# Altium schematic sheet AMS.SchDoc
size Legal
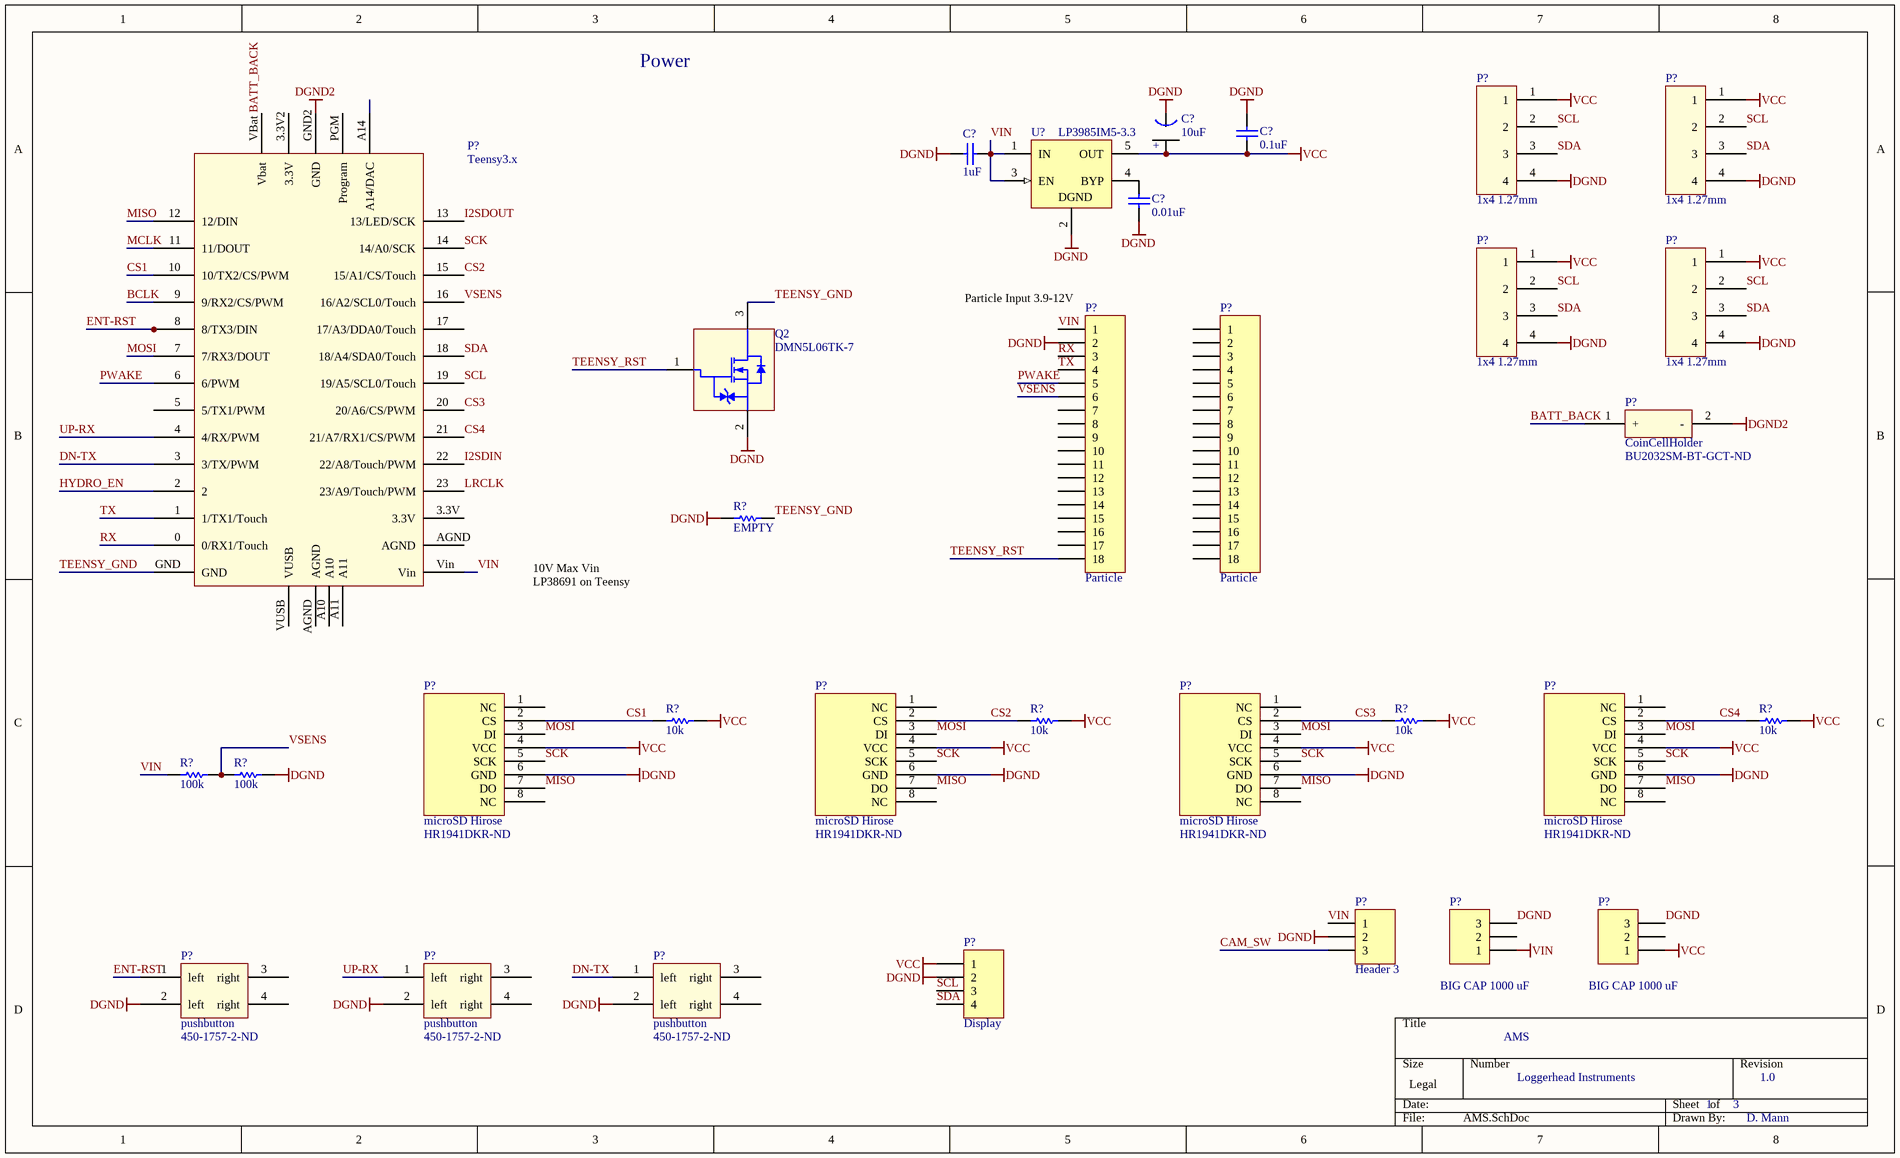
[diagram p0: AMS.SchDoc]

## Parts
(Parts that share a designator on the sheet are numbered #1, #2 ... from top to bottom, then left to right.)
C?#1  0.1uF  [0402]
C?#2  10uF  [Tant0805]
C?#3  1uF  [0402]
C?#4  0.01uF  [0402]
P?#1  1x4 1.27mm  [Header1x4 1.27mm]
P?#2  1x4 1.27mm  [Header1x4 1.27mm]
P?#3  1x4 1.27mm  [Header1x4 1.27mm]
P?#4  1x4 1.27mm  [Header1x4 1.27mm]
P?#5  Particle  [HDR1X18]
P?#6  Particle  [HDR1X18]
P?#7  Teensy3.x  [Teensy3.x]
P?#8  CoinCellHolder  Supplier Part Number 1: BU2032SM-BT-GCT-ND  [CoinCellHolder]
P?#9  microSD Hirose  Supplier Part Number 1: HR1941DKR-ND  [DM3D microSD]
P?#10  microSD Hirose  Supplier Part Number 1: HR1941DKR-ND  [DM3D microSD]
P?#11  microSD Hirose  Supplier Part Number 1: HR1941DKR-ND  [DM3D microSD]
P?#12  microSD Hirose  Supplier Part Number 1: HR1941DKR-ND  [DM3D microSD]
P?#13  Header 3  [HDR1X3]
P?#14  Display  [HDR1X4]
P?#15  BIG CAP 1000 uF  [HDR1X3]
P?#16  BIG CAP 1000 uF  [HDR1X3]
P?#17  pushbutton  Supplier Part Number 1: 450-1757-2-ND  [SOP4]
P?#18  pushbutton  Supplier Part Number 1: 450-1757-2-ND  [SOP4]
P?#19  pushbutton  Supplier Part Number 1: 450-1757-2-ND  [SOP4]
Q2  DMN5L06TK-7  [SOT-523]
R?#1  EMPTY  [3-0603]
R?#2  10k  [3-0603]
R?#3  10k  [3-0603]
R?#4  10k  [3-0603]
R?#5  10k  [3-0603]
R?#6  100k  [3-0603]
R?#7  100k  [3-0603]
U?  LP3985IM5-3.3  [MF05A_N]

## Nets
DGND: C?#1.2 C?#2.1(GND) C?#3.2 C?#4.2 P?#1.4 P?#2.4 P?#3.4 P?#4.4 P?#5.2 P?#9.6(GND) P?#10.6(GND) P?#11.6(GND) P?#12.6(GND) P?#13.2 P?#14.2 P?#15.3 P?#16.3 P?#17.2(left) P?#18.2(left) P?#19.2(left) Q2.2(S) R?#1.2 R?#7.1 U?.2(GND)
DGND2: P?#7.GND2(GND) P?#8.2(-)
VCC: C?#1.1 C?#2.2(+) P?#1.1 P?#2.1 P?#3.1 P?#4.1 P?#9.4(VCC) P?#10.4(VCC) P?#11.4(VCC) P?#12.4(VCC) P?#14.1 P?#16.1 R?#2.1 R?#3.1 R?#4.1 R?#5.1 U?.5(OUT)
VIN: C?#3.1 P?#5.1 P?#7.Vin P?#13.1 P?#15.1 R?#6.2 U?.1(IN) U?.3(EN)
BATT_BACK: P?#7.VBat(Vbat) P?#8.1(+)
BCLK: P?#7.9(9/RX2/CS/PWM)
CAM_SW: P?#13.3
CS1: P?#7.10(10/TX2/CS/PWM) P?#9.2(CS) R?#2.2
CS2: P?#7.15(15/A1/CS/Touch) P?#10.2(CS) R?#3.2
CS3: P?#7.20(20/A6/CS/PWM) P?#11.2(CS) R?#4.2
CS4: P?#7.21(21/A7/RX1/CS/PWM) P?#12.2(CS) R?#5.2
DN-TX: P?#7.3(3/TX/PWM) P?#19.1(left)
ENT-RST: P?#7.8(8/TX3/DIN) P?#17.1(left)
HYDRO_EN: P?#7.2
I2SDIN: P?#7.22(22/A8/Touch/PWM)
I2SDOUT: P?#7.13(13/LED/SCK)
LRCLK: P?#7.23(23/A9/Touch/PWM)
MCLK: P?#7.11(11/DOUT)
MISO: P?#7.12(12/DIN) P?#9.7(DO) P?#10.7(DO) P?#11.7(DO) P?#12.7(DO)
MOSI: P?#7.7(7/RX3/DOUT) P?#9.3(DI) P?#10.3(DI) P?#11.3(DI) P?#12.3(DI)
PWAKE: P?#5.5 P?#7.6(6/PWM)
RX: P?#5.3 P?#7.0(0/RX1/Touch)
SCK: P?#7.14(14/A0/SCK) P?#9.5(SCK) P?#10.5(SCK) P?#11.5(SCK) P?#12.5(SCK)
SCL: P?#1.2 P?#2.2 P?#3.2 P?#4.2 P?#7.19(19/A5/SCL0/Touch) P?#14.3
SDA: P?#1.3 P?#2.3 P?#3.3 P?#4.3 P?#7.18(18/A4/SDA0/Touch) P?#14.4
TEENSY_GND: P?#7.GND Q2.3(D) R?#1.1
TEENSY_RST: P?#5.18 Q2.1(G)
TX: P?#5.4 P?#7.1(1/TX1/Touch)
UP-RX: P?#7.4(4/RX/PWM) P?#18.1(left)
VSENS: P?#5.6 P?#7.16(16/A2/SCL0/Touch) R?#6.1 R?#7.2
NetC?#4_1: C?#4.1 U?.4(BYP)

Not connected (* = marked no-connect by the designer): P?#5 7 8 9 10 11 12 13 14 15 16 17; P?#6 1 2 3 4 5 6 7 8 9 10 11 12 13 14 15 16 17 18; P?#7 3.3V 3.3V2(3.3V) 5(5/TX1/PWM) 17(17/A3/DDA0/Touch) A10 A11 A14(A14/DAC) AGND PGM(Program) VUSB; P?#9 1(NC) 8(NC); P?#10 1(NC) 8(NC); P?#11 1(NC) 8(NC); P?#12 1(NC) 8(NC); P?#15 2; P?#16 2; P?#17 3(right) 4(right); P?#18 3(right) 4(right); P?#19 3(right) 4(right)

## Notes on the sheet
- Power
- (near P?#5) Particle Input 3.9-12V
- 10V Max Vin
  LP38691 on Teensy
- AMS
- Loggerhead Instruments
- 1
- 3
- 1.0
- D. Mann
- (in symbol LP3985IM5-3.3) DGND

## Library data of the parts
C?#1 = C0402: Ceramic Chip Capacitor - Standard; Note: Footprint corresponds to dimensions for bulk cassette packaging. This case size has tightened tolerances.; Published: 17-Jul-2002; LatestRevisionDate: 19-Mar-2004; LatestRevisionNote: Silkscreen size reduced.; DatasheetDocument: Mar-2001; PackageDocument: Mar-2001; PackageReference: 0402; Publisher: Altium Limited; Code_JEITA: 0402; Code_IPC: 1005 [0402]; ComponentLink1Description: Manufacturer Link; ComponentLink1URL: http://www.kemet.com/; ComponentLink2Description: Datasheet; ComponentLink2URL: http://www.kemet.com/kemet/web/homepage/kechome.nsf/vapubfilesname/F3102TA.pdf/$file/F3102TA.pdf; Value: 0.1uF
C?#2 = Tant0805: Value: 10uF
C?#3 C?#4 = C0402: Ceramic Chip Capacitor - Standard; Note: Footprint corresponds to dimensions for bulk cassette packaging. This case size has tightened tolerances.; Value: 0.1uF; Published: 17-Jul-2002; LatestRevisionDate: 19-Mar-2004; LatestRevisionNote: Silkscreen size reduced.; DatasheetDocument: Mar-2001; PackageDocument: Mar-2001; PackageReference: 0402; Publisher: Altium Limited; Code_JEITA: 0402; Code_IPC: 1005 [0402]; ComponentLink1Description: Manufacturer Link; ComponentLink1URL: http://www.kemet.com/; ComponentLink2Description: Datasheet; ComponentLink2URL: http://www.kemet.com/kemet/web/homepage/kechome.nsf/vapubfilesname/F3102TA.pdf/$file/F3102TA.pdf
P?#1-P?#4 = Header 1x4 1.27mm
P?#5 P?#6 = Header 18: Header, 18-Pin; LatestRevisionDate: 17-Jul-2002; LatestRevisionNote: Re-released for DXP Platform.; Publisher: Altium Limited
P?#13 P?#15 P?#16 = Header 3: Header, 3-Pin; LatestRevisionDate: 17-Jul-2002; LatestRevisionNote: Re-released for DXP Platform.; Publisher: Altium Limited
P?#14 = Header 4: Header, 4-Pin; LatestRevisionDate: 17-Jul-2002; LatestRevisionNote: Re-released for DXP Platform.; Publisher: Altium Limited
Q2 = FET DMN5L06TK-7: Ultra-low leakage Enhanced MOSFET; Fabrication Tested: NO; Creator and Date: Will Flanery 2010-09-02; Footprint Verified By: *; Schematic Verified By: *; Vendor Info Verified By: *; Supplier 1: Digi-Key; Supplier Part Number 1: DMN5L06TKDICT-ND; HelpURL: http://www.diodes.com/datasheets/ds30926.pdf
R?#1-R?#7 = ERJ3RK: Precision Thick Film Chip Resistor, 10 Ohm to 1M Ohm Range, 1% and 0.5% Tolerance, 0603 Size, 0.063 W; Published: 17-Dec-2003; LatestRevisionDate: 19-Mar-2004; LatestRevisionNote: Silkscreen size reduced.; PackageDocument: Mar-2003; PackageReference: 3-0603; Publisher: Altium Limited; Code_IPC: 1608 [0603]; ComponentLink1Description: Manufacturer Link; ComponentLink1URL: http://www.panasonic.com/industrial/components/resistive_products.htm; ComponentLink2Description: Datasheet; ComponentLink2URL: http://www.panasonic.com/industrial/components/pdf/AOA0000CE2.pdf
U? = LP3985IM5-3.3: Micropower, 150mA Low-Noise Ultra Low-Dropout CMOS Voltage Regulator; Manufacturer: National Semiconductor; CompType: LDO IC; PackageTopMarking: LDQB*XTT; PowerWise: N; Published: 4-Dec-2008; DatasheetVersion: Aug-2005; PackageVersion: revD, Aug-2008; PackageReference: MF05A; Publisher: Altium Limited; PackageDescription: Molded SOT-23, .115 x .063 x .040 in Body, 5 Lead, .0375 in Pitch; PartNumber: LP3985IM5-3.3; RoHS: O; PinCount: 5; DigiKeyPartNumber: LP3985IM5-3.3CT-ND; ComponentLink1Description: LP3985 Datasheet; ComponentLink1URL: http://www.national.com/ds/LP/LP3985.pdf; ComponentLink2Description: LP3985 Web Page; ComponentLink2URL: http://www.national.com/pf/LP/LP3985.html; ComponentLink3Description: MF05A Package Page; ComponentLink3URL: http://www.national.com/packaging/folders/mf05a.html
P?#8 = CoinCellHolder: Supplier 1: Digi-Key
P?#9-P?#12 = microSD Hirose: Supplier 1: Digi-Key
P?#17-P?#19 = pushbutton: Supplier 1: Digi-Key